# Altium schematic sheet Wireless.SchDoc
size A; SheetNumber: 4; SheetTotal: 5
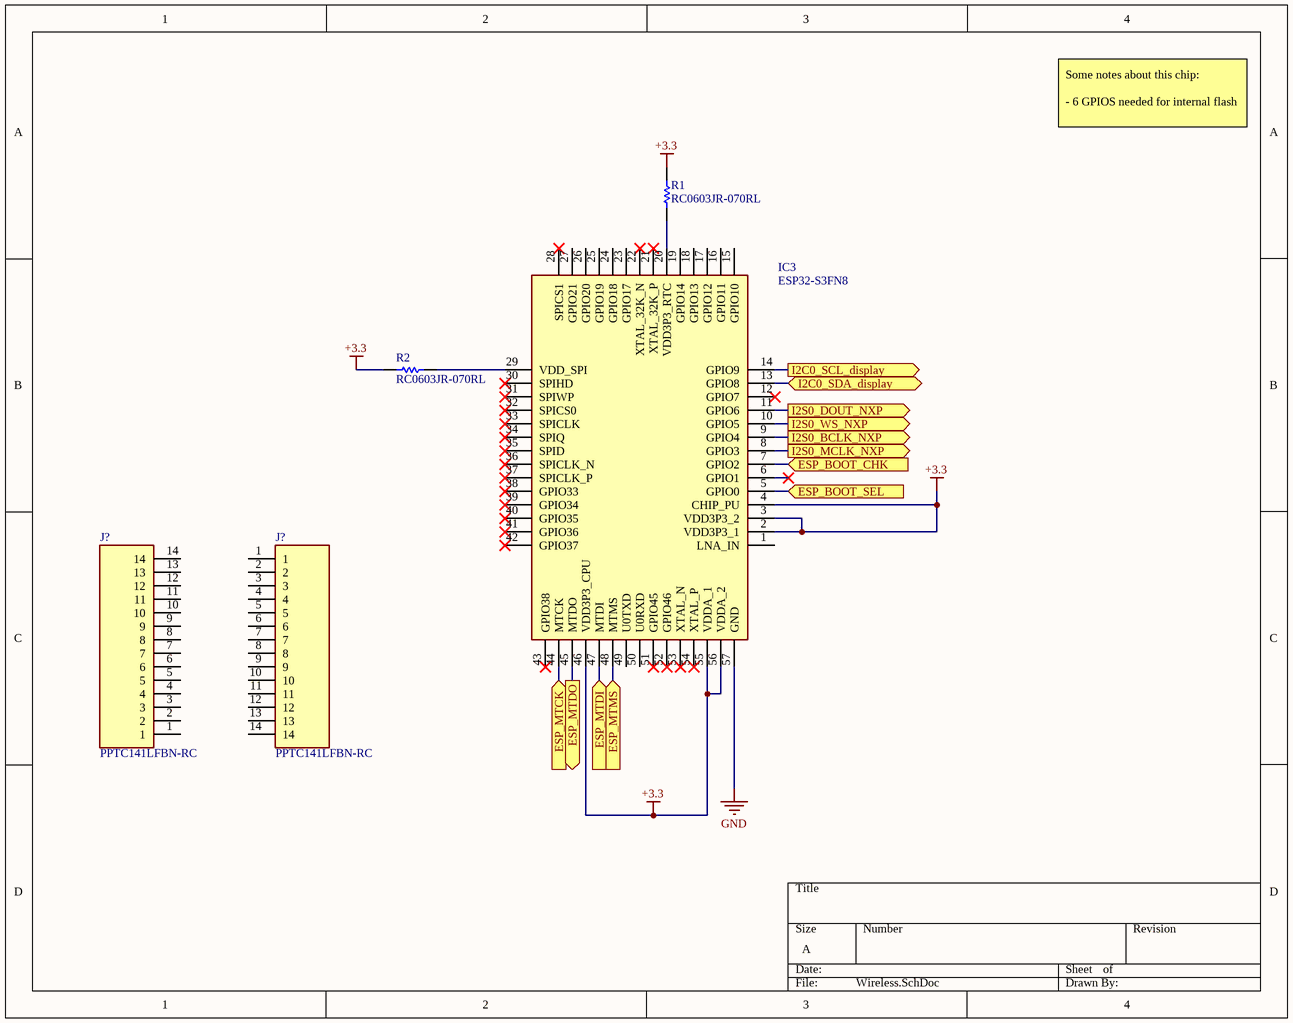
[diagram p0: Wireless.SchDoc]

## Parts
(Parts that share a designator on the sheet are numbered #1, #2 ... from top to bottom, then left to right.)
IC3  ESP32-S3FN8  [QFN40P700X700X90-57N-D]
J?#1  PPTC141LFBN-RC  [RHDR14W80P0X254_1X14_3606X254X850P]
J?#2  PPTC141LFBN-RC  [RHDR14W80P0X254_1X14_3606X254X850P]
R1  RC0603JR-070RL  [RESC1608X55X25ML10T15]
R2  RC0603JR-070RL  [RESC1608X55X25ML10T15]

## Ports
ESP_BOOT_CHK (in), ESP_BOOT_SEL (in), ESP_MTCK (in), ESP_MTDI (in), ESP_MTDO (out), ESP_MTMS (in), I2C0_SCL_display (out), I2C0_SDA_display (bidir), I2S0_BCLK_NXP (out), I2S0_DOUT_NXP (out), I2S0_MCLK_NXP (out), I2S0_WS_NXP (out)

## Nets
+3.3: IC3.2(VDD3P3_1) IC3.3(VDD3P3_2) IC3.4(CHIP_PU) IC3.46(VDD3P3_CPU) IC3.55(VDDA_1) IC3.56(VDDA_2) R1.1 R2.1
GND: IC3.57(GND)
ESP_BOOT_CHK: IC3.7(GPIO2) ; port ESP_BOOT_CHK
ESP_BOOT_SEL: IC3.5(GPIO0) ; port ESP_BOOT_SEL
ESP_MTCK: IC3.44(MTCK) ; port ESP_MTCK
ESP_MTDI: IC3.47(MTDI) ; port ESP_MTDI
ESP_MTDO: IC3.45(MTDO) ; port ESP_MTDO
ESP_MTMS: IC3.48(MTMS) ; port ESP_MTMS
I2C0_SCL_display: IC3.14(GPIO9) ; port I2C0_SCL_display
I2C0_SDA_display: IC3.13(GPIO8) ; port I2C0_SDA_display
I2S0_BCLK_NXP: IC3.9(GPIO4) ; port I2S0_BCLK_NXP
I2S0_DOUT_NXP: IC3.11(GPIO6) ; port I2S0_DOUT_NXP
I2S0_MCLK_NXP: IC3.8(GPIO3) ; port I2S0_MCLK_NXP
I2S0_WS_NXP: IC3.10(GPIO5) ; port I2S0_WS_NXP
NetIC3_20: IC3.20(VDD3P3_RTC) R1.2
NetIC3_29: IC3.29(VDD_SPI) R2.2

Not connected (* = marked no-connect by the designer): IC3 1(LNA_IN) 6(GPIO1)* 12(GPIO7)* 15(GPIO10) 16(GPIO11) 17(GPIO12) 18(GPIO13) 19(GPIO14) 21(XTAL_32K_P)* 22(XTAL_32K_N)* 23(GPIO17) 24(GPIO18) 25(GPIO19) 26(GPIO20) 27(GPIO21) 28(SPICS1)* 30(SPIHD)* 31(SPIWP)* 32(SPICS0)* 33(SPICLK)* 34(SPIQ)* 35(SPID)* 36(SPICLK_N)* 37(SPICLK_P)* 38(GPIO33)* 39(GPIO34)* 40(GPIO35)* 41(GPIO36)* 42(GPIO37)* 43(GPIO38)* 49(U0TXD) 50(U0RXD) 51(GPIO45)* 52(GPIO46)* 53(XTAL_N)* 54(XTAL_P)*; J?#1 1 2 3 4 5 6 7 8 9 10 11 12 13 14; J?#2 1 2 3 4 5 6 7 8 9 10 11 12 13 14

## Notes on the sheet
- Some notes about this chip:
  - 6 GPIOS needed for internal flash

## Library data of the parts
IC3 = ESP32-S3FN8: Integrated Circuit; Manufacturer_Name: Espressif Systems; Datasheet Link: https://www.espressif.com/sites/default/files/documentation/esp32-s3_datasheet_en.pdf; Height: 0.9mm; Manufacturer_Part_Number: ESP32-S3FN8; Mouser Part Number: 356-ESP32-S3FN8; Mouser Price/Stock: https://www.mouser.co.uk/ProductDetail/Espressif-Systems/ESP32-S3FN8?qs=Rp5uXu7WBW%2F4Oihh5tkiVQ%3D%3D
J?#1 J?#2 = PPTC141LFBN-RC: Connector; Manufacturer_Name: Sullins; Datasheet Link: http://www.sullinscorp.com/drawings/78_P(N)PxCxxxLFBN-RC,_10492-H.pdf; Height: 8.5mm; Manufacturer_Part_Number: PPTC141LFBN-RC
R1 R2 = CMP-2100-03667-1: Chip Resistor, 0 Ohm, +/- 5%, 0.1 W, -55 to 155 degC, 0603 (1608 Metric), RoHS, Tape and Reel; Manufacturer: Yageo; Temperature Coefficient: 200ppm/degreesC; Voltage Rating: 50V; Power Rating: 100mW; Resistance: 0mOhm; Width: 0.8mm; Max Operating Temperature: 155degC; Tolerance: 5%; Package Reference: 0603; Height: 0.45mm; Depth: 0.8mm; Package Description: 2-Pin Surface Mount Device, Body 1.6 x 0.8 mm; Termination: SMD/SMT; Package Quantity: 5000; Case/Package: 0603; Case Code (Imperial): 0603; Radiation Hardening: No; Number of Pins: 2; Length: 1.6mm; Lead Free: LeadFree; Voltage Rating (DC): 50V; Military Standard: Not; Datasheet URL: http://www.yageo.com/NewPortal/yageodocoutput?fileName=/pdf/R-Chip/PYu-RC_Group_51_RoHS_L_5.pdf; Manufacturer URL: http://www.yageo.com/; Packaging: TapeandReel; Case Code (Metric): 1608; Min Operating Temperature: -55degC; Composition: ThickFilm; RoHSCompliant: true; Contact Plating: Tin; Datasheet Version: Rev. 5, 10/2016; REACH SVHC: NoSVHC